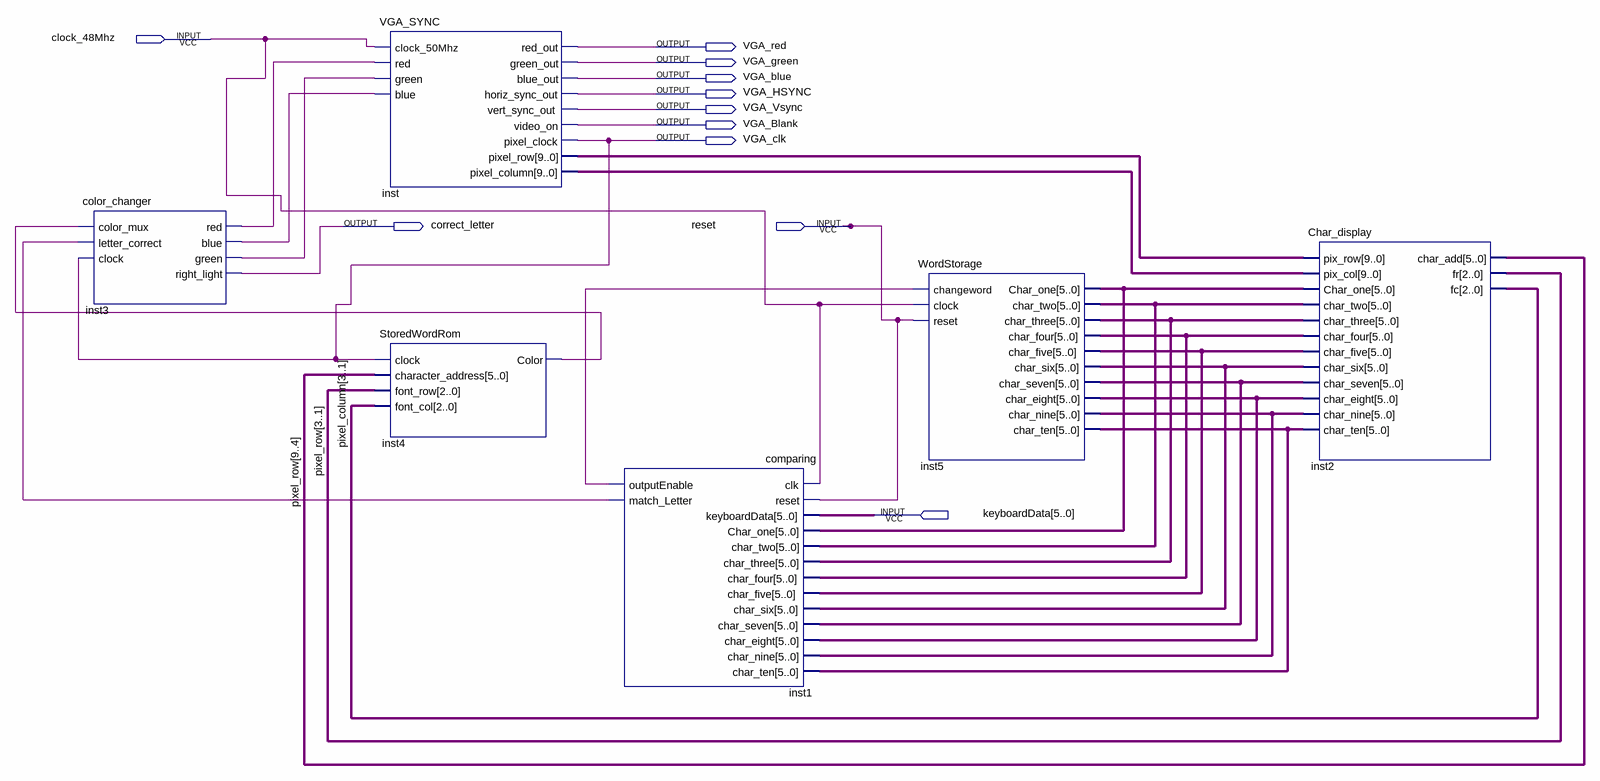
[diagram p0: schematic sheet]
// Quartus schematic vgacomp.bdf as structural Verilog: 6 symbols, 11 pins
module vgacomp (
  input  clock_48Mhz,
  input  reset,
  input  [5:0] keyboardData,
  output VGA_red,
  output VGA_green,
  output VGA_blue,
  output VGA_HSYNC,
  output VGA_Vsync,
  output VGA_Blank,
  output VGA_clk,
  output correct_letter
);

  wire inst1_match_letter, inst1_outputenable, inst3_blue, inst3_green, inst3_red, inst4_color;
  wire [3:1] pixel_column;
  wire [5:0] inst5_char_eight, inst5_char_five, inst5_char_four, inst5_char_nine, inst5_char_one,
       inst5_char_seven, inst5_char_six, inst5_char_ten, inst5_char_three, inst5_char_two;
  wire [9:0] inst_pixel_column, inst_pixel_row;
  wire [9:1] pixel_row;

  color_changer inst3 (
    .color_mux(inst4_color), .letter_correct(inst1_match_letter), .clock(VGA_clk), .red(inst3_red),
    .blue(inst3_blue), .green(inst3_green), .right_light(correct_letter));
  VGA_SYNC inst (
    .clock_50Mhz(clock_48Mhz), .red(inst3_red), .green(inst3_green), .blue(inst3_blue), .red_out(VGA_red),
    .green_out(VGA_green), .blue_out(VGA_blue), .horiz_sync_out(VGA_HSYNC), .vert_sync_out(VGA_Vsync),
    .video_on(VGA_Blank), .pixel_clock(VGA_clk), .pixel_row(inst_pixel_row), .pixel_column(inst_pixel_column));
  StoredWordRom inst4 (
    .clock(VGA_clk), .character_address(pixel_row[9:4]), .font_row(pixel_row[3:1]), .font_col(pixel_column),
    .Color(inst4_color));
  comparing inst1 (
    .clk(clock_48Mhz), .reset(reset), .keyboardData(keyboardData), .Char_one(inst5_char_one),
    .char_two(inst5_char_two), .char_three(inst5_char_three), .char_four(inst5_char_four),
    .char_five(inst5_char_five), .char_six(inst5_char_six), .char_seven(inst5_char_seven),
    .char_eight(inst5_char_eight), .char_nine(inst5_char_nine), .char_ten(inst5_char_ten),
    .outputEnable(inst1_outputenable), .match_Letter(inst1_match_letter));
  WordStorage inst5 (
    .changeword(inst1_outputenable), .clock(clock_48Mhz), .reset(reset), .Char_one(inst5_char_one),
    .char_two(inst5_char_two), .char_three(inst5_char_three), .char_four(inst5_char_four),
    .char_five(inst5_char_five), .char_six(inst5_char_six), .char_seven(inst5_char_seven),
    .char_eight(inst5_char_eight), .char_nine(inst5_char_nine), .char_ten(inst5_char_ten));
  Char_display inst2 (
    .pix_row(inst_pixel_row), .pix_col(inst_pixel_column), .Char_one(inst5_char_one),
    .char_two(inst5_char_two), .char_three(inst5_char_three), .char_four(inst5_char_four),
    .char_five(inst5_char_five), .char_six(inst5_char_six), .char_seven(inst5_char_seven),
    .char_eight(inst5_char_eight), .char_nine(inst5_char_nine), .char_ten(inst5_char_ten),
    .char_add(pixel_row[9:4]), .fr(pixel_row[3:1]), .fc(pixel_column));
endmodule
